# EAGLE design ATRescueBoard (EAGLE 7.7.0)
VERSION: 1.0
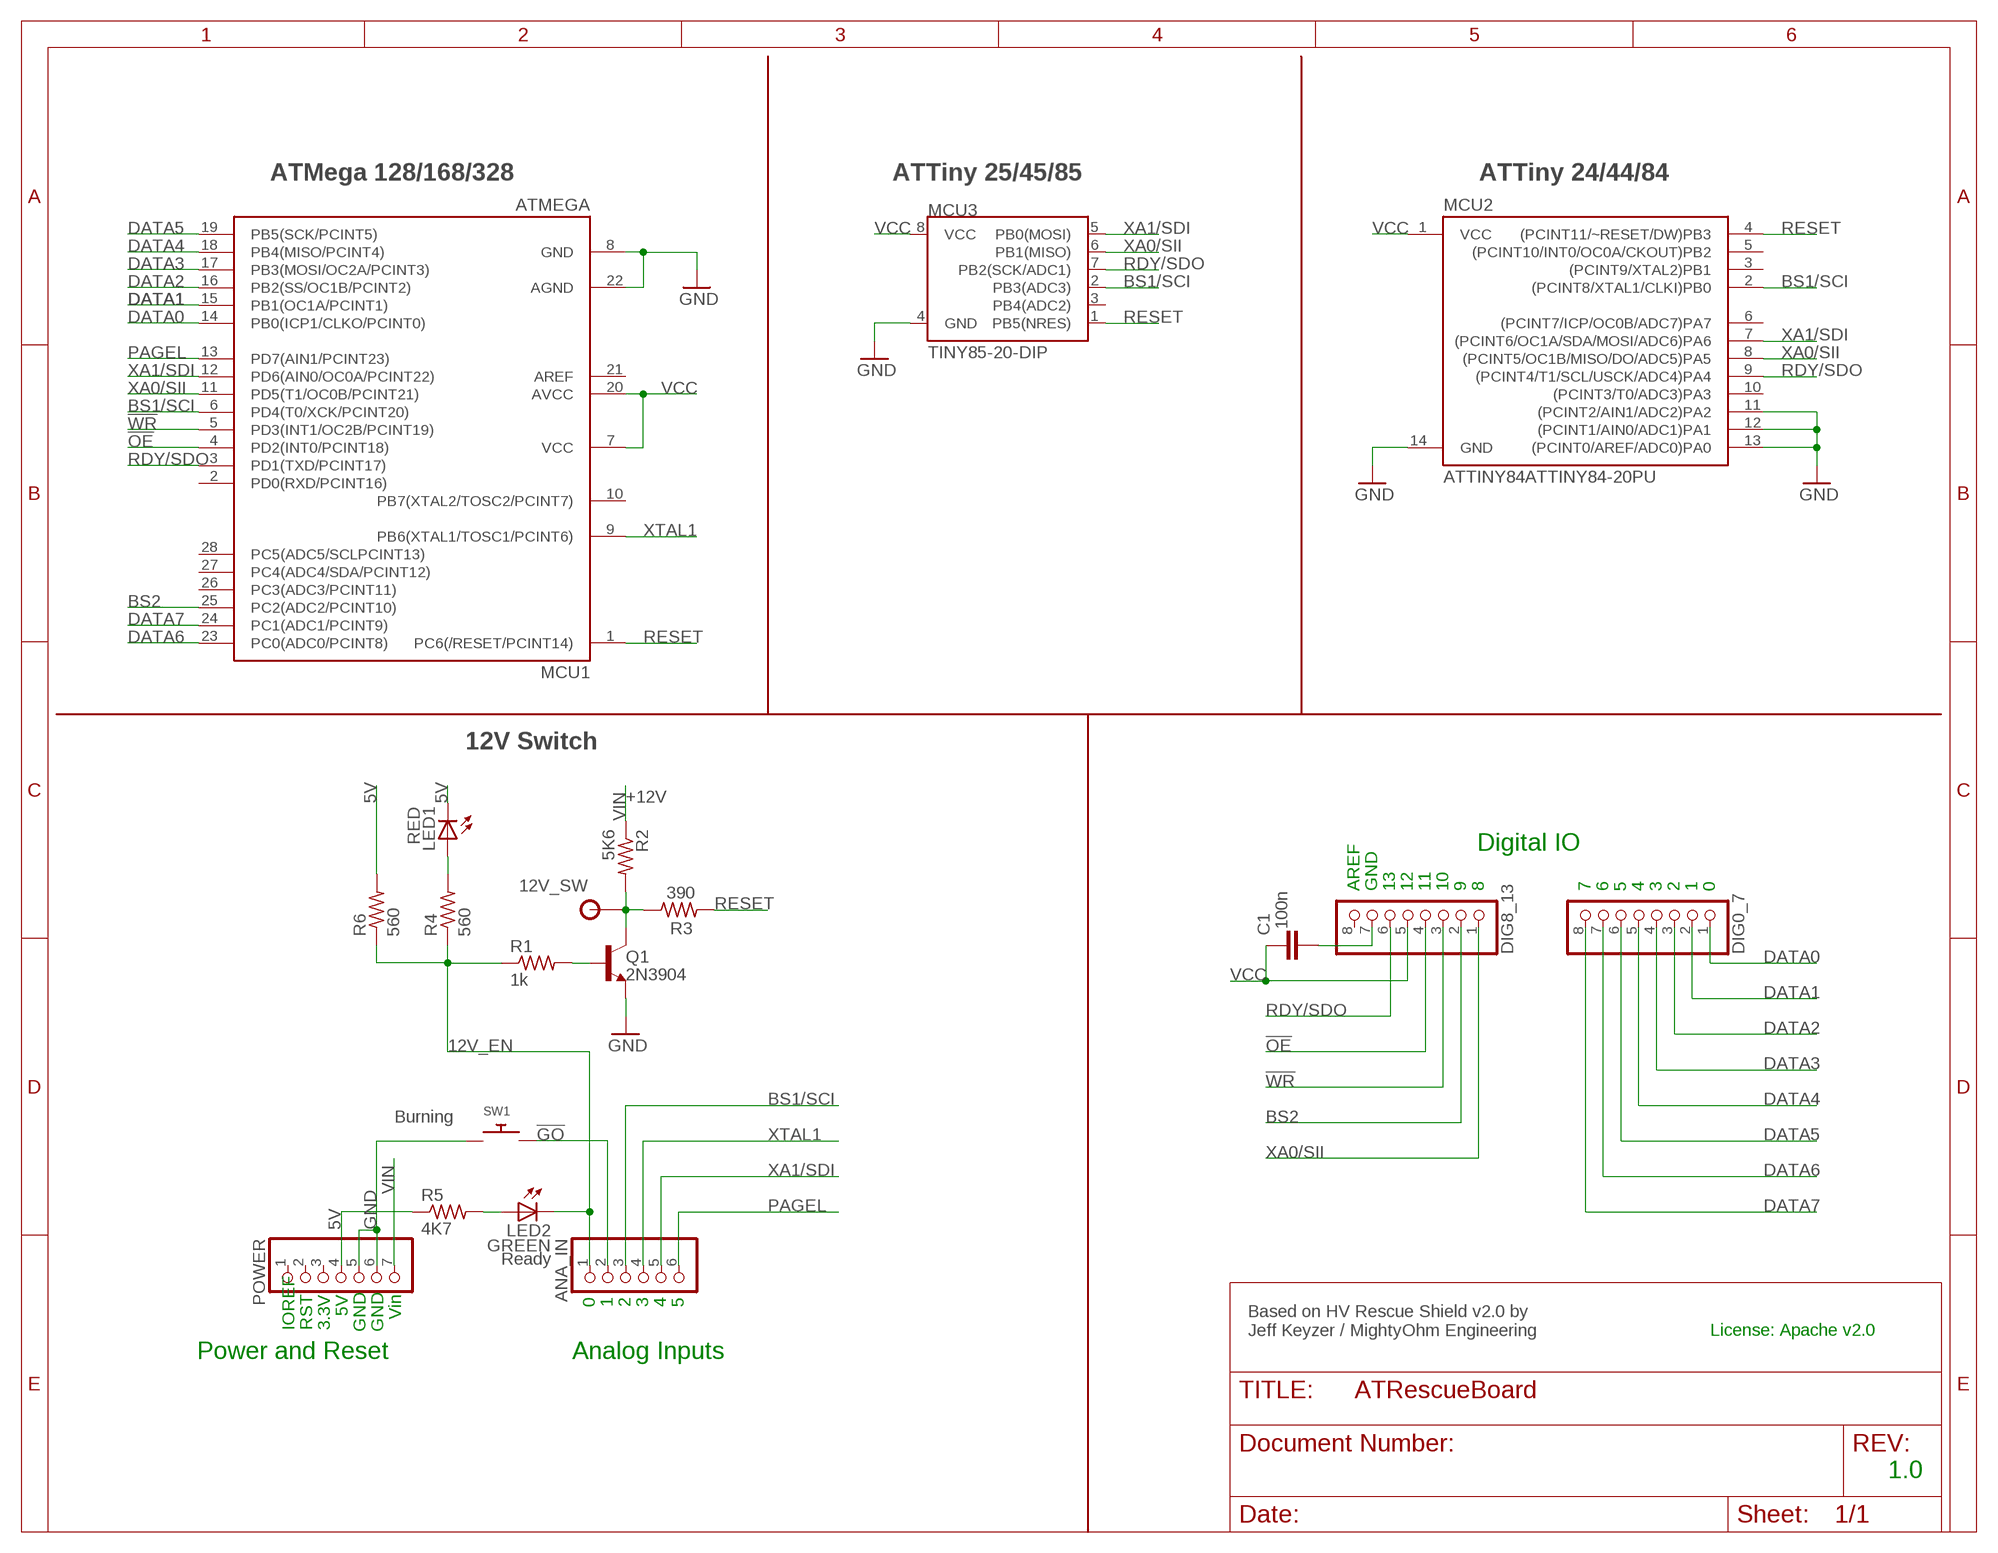
[diagram p0: schematic, sheet 1]

## Parts
ANA_IN  PINHD-1X6  [1X06]
C1  100n  C-EU050-024X044  [C050-024X044]
DIG0_7  PINHD-1X8  [1X08]
DIG8_13  PINHD-1X8  [1X08]
LED1  RED  LED5MM  [LED5MM]
LED2  GREEN  LED5MM  [LED5MM]
MCU1  ATMEGA  MEGA48/88/168-PU  [DIL28-3]
MCU2  ATTINY84ATTINY84-20PU  [DIL14]
MCU3  TINY85-20-DIP  ATTINY45TINY85-20-DIP  [DIP08]
POWER  PINHD-1X7  [1X07]
Q1  2N3904  [TO92-]
R1  1k  R-US_0204/7  [0204/7]
R2  5K6  R-US_0207/10  [0207/10]
R3  390  R-US_0309/12  [0309/12]
R4  560  R-US_0309/12  [0309/12]
R5  4K7  R-US_0204/7  [0204/7]
R6  560  R-US_0309/12  [0309/12]
SW1  SWITCH_PUSHBUTTONEVQ-PE  [TACT_PANA-EVQ]
TP1  12V_SW  TPPTH  [TP_PTH]

## Nets
5V [5v]: LED1.K(C) POWER.4 R5.1 R6.2
12V_EN: ANA_IN.1 LED2.K(C) R1.1 R4.1 R6.1
12V_SW [power]: Q1.1(C) R2.2 R3.1 TP1.P$1(TP)
!GO: ANA_IN.2 SW1.P$2
!OE: DIG8_13.4 MCU1.4(PD2(INT0/PCINT18))
!WR: DIG8_13.3 MCU1.5(PD3(INT1/OC2B/PCINT19))
BS1/SCI: ANA_IN.3 MCU1.6(PD4(T0/XCK/PCINT20)) MCU2.2((PCINT8/XTAL1/CLKI)PB0) MCU3.2(PB3(ADC3))
BS2: DIG8_13.2 MCU1.25(PC2(ADC2/PCINT10))
DATA0: DIG0_7.1 MCU1.14(PB0(ICP1/CLKO/PCINT0))
DATA1: DIG0_7.2 MCU1.15(PB1(OC1A/PCINT1))
DATA2: DIG0_7.3 MCU1.16(PB2(SS/OC1B/PCINT2))
DATA3: DIG0_7.4 MCU1.17(PB3(MOSI/OC2A/PCINT3))
DATA4: DIG0_7.5 MCU1.18(PB4(MISO/PCINT4))
DATA5: DIG0_7.6 MCU1.19(PB5(SCK/PCINT5))
DATA6: DIG0_7.7 MCU1.23(PC0(ADC0/PCINT8))
DATA7: DIG0_7.8 MCU1.24(PC1(ADC1/PCINT9))
GND [gnd]: MCU1.8(GND) MCU1.22(AGND) MCU2.11((PCINT2/AIN1/ADC2)PA2) MCU2.12((PCINT1/AIN0/ADC1)PA1) MCU2.13((PCINT0/AREF/ADC0)PA0) MCU2.14(GND) MCU3.4(GND) POWER.5 POWER.6 Q1.3(E) SW1.P$1
N$1: Q1.2(B) R1.2
N$2: LED1.A R4.2
N$7: LED2.A R5.2
N$21: C1.1 DIG8_13.7
PAGEL: ANA_IN.6 MCU1.13(PD7(AIN1/PCINT23))
RDY/SDO: DIG8_13.6 MCU1.3(PD1(TXD/PCINT17)) MCU2.9((PCINT4/T1/SCL/USCK/ADC4)PA4) MCU3.7(PB2(SCK/ADC1))
RESET [power]: MCU1.1(PC6(/RESET/PCINT14)) MCU2.4((PCINT11/~RESET/DW)PB3) MCU3.1(PB5(NRES)) R3.2
VCC: C1.2 DIG8_13.5 MCU1.7(VCC) MCU1.20(AVCC) MCU2.1(VCC) MCU3.8(VCC)
VIN [power]: POWER.7 R2.1
XA0/SII: DIG8_13.1 MCU1.11(PD5(T1/OC0B/PCINT21)) MCU2.8((PCINT5/OC1B/MISO/DO/ADC5)PA5) MCU3.6(PB1(MISO))
XA1/SDI: ANA_IN.5 MCU1.12(PD6(AIN0/OC0A/PCINT22)) MCU2.7((PCINT6/OC1A/SDA/MOSI/ADC6)PA6) MCU3.5(PB0(MOSI))
XTAL1: ANA_IN.4 MCU1.9(PB6(XTAL1/TOSC1/PCINT6))
Unconnected: DIG8_13.8 MCU1.2(PD0(RXD/PCINT16)) MCU1.10(PB7(XTAL2/TOSC2/PCINT7)) MCU1.21(AREF) MCU1.26(PC3(ADC3/PCINT11)) MCU1.27(PC4(ADC4/SDA/PCINT12)) MCU1.28(PC5(ADC5/SCLPCINT13)) MCU2.3((PCINT9/XTAL2)PB1) MCU2.5((PCINT10/INT0/OC0A/CKOUT)PB2) MCU2.6((PCINT7/ICP/OC0B/ADC7)PA7) MCU2.10((PCINT3/T0/ADC3)PA3) MCU3.3(PB4(ADC2)) POWER.1 POWER.2 POWER.3

## Notes on the sheet
- ATMega 128/168/328 | ATTiny 25/45/85 | ATTiny 24/44/84
- 12V Switch
- +12V
- Digital IO
- AREF | GND | 13 | 12 | 11 | 10 | 9 | 8 | 7 | 6 | 5 | 4 | 3 | 2 | 1 | 0
- Burning
- Ready
- 0 | 1 | 2 | 3 | 4 | 5
- 5V | Vin
- IOREF | RST | 3.3V | GND | GND
- Based on HV Rescue Shield v2.0 by 
  Jeff Keyzer / MightyOhm Engineering
- License: Apache v2.0
- Power and Reset | Analog Inputs

## Library data of the parts
ANA_IN = mightyohm:PINHD-1X6: PIN HEADER
C1 = SmartPrj:C-EU: CAPACITOR, European symbol
DIG0_7 DIG8_13 = mightyohm:PINHD-1X8: PIN HEADER
LED1 LED2 = mightyohm:LED: MightyOhm Engineering Light Emitting Diodes (LEDs)
MCU1 = avr-4:MEGA48/88/168-PU
MCU2 = SparkFun-DigitalIC:ATTINY84: Atmel 14-pin 2/4/8kB flash uC
MCU3 = SparkFun-DigitalIC:ATTINY45: Atmel 8-pin 2/4/8kB flash uC; PROD_ID: IC-09445
POWER = pinhead:PINHD-1X7: PIN HEADER
Q1 = gm-trans:2N3904: NPN Transistor
R1-R6 = rcl:R-US_: RESISTOR, American symbol
SW1 = adafruit:SWITCH_PUSHBUTTON: Buttons SOFTTOUCHSMD_SJ - Soft touch temporary push button (Super Junk Akihabara) Compatible with SKPMANE010 [Mouser: 688-SKPMAN] C&K_KSS = Digikey: KSS221GLFS
TP1 = connectors:TP: Test Point JSK 1/14/11

## Net classes
0 default: width 0.305 mm, drill 0.508 mm, clearance 0.203 mm
1 power: width 0.61 mm, drill 0.508 mm, clearance 0.152 mm
2 gnd: width 0.305 mm, drill 0.508 mm, clearance 0.152 mm
3 5v: width 0.356 mm, drill 0.508 mm, clearance 0.152 mm
4 aref: width 0.406 mm

## Board
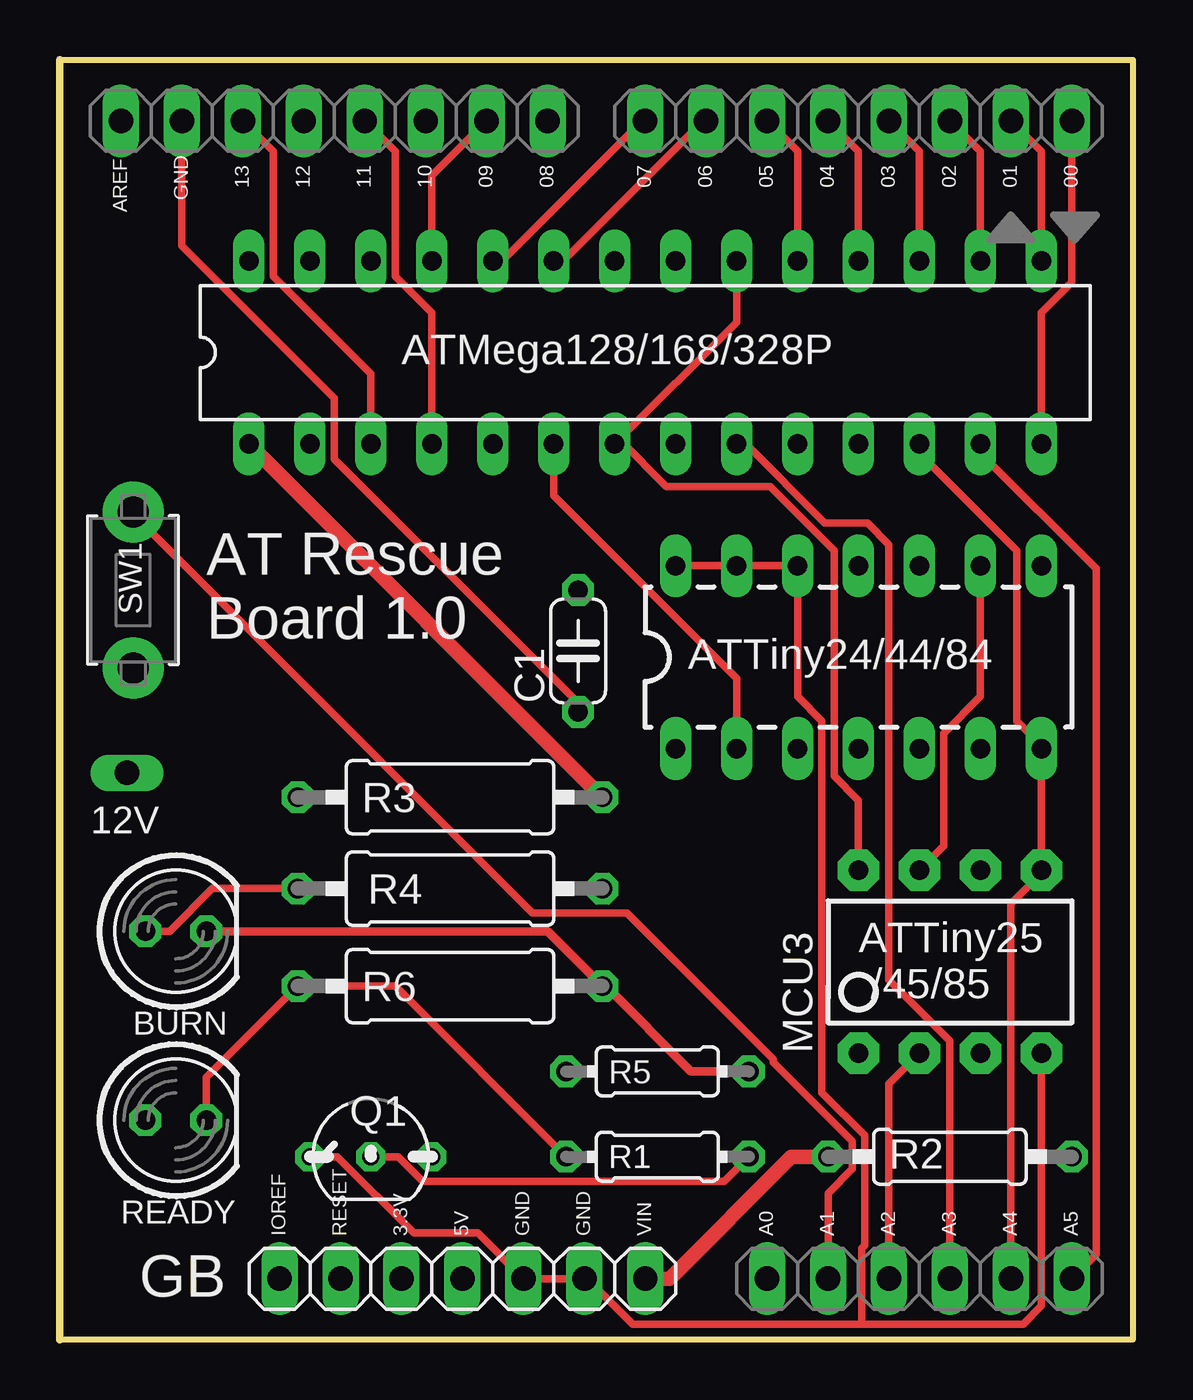
[diagram p1: board, top side]
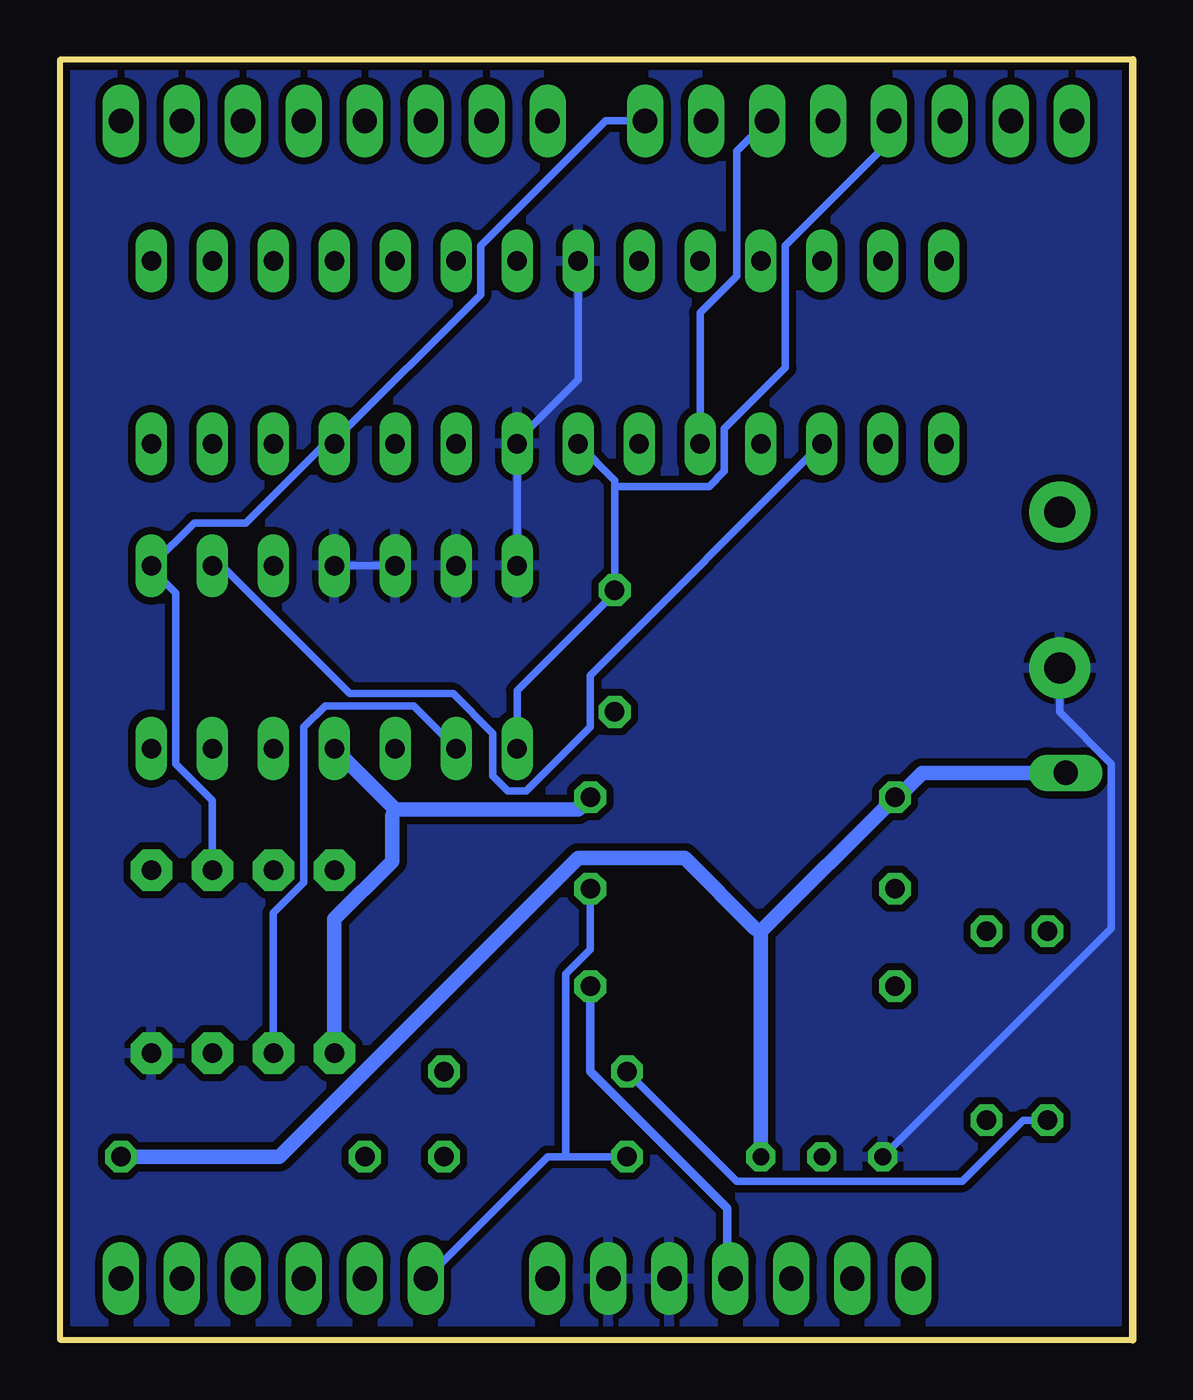
[diagram p2: board, bottom side, seen from below]

Size 44.7 x 53.34 mm. Coordinates in mm from the lower left corner, seen from the top.
Outline: 0,53.34 44.7,53.34 44.7,0 0,0 0,53.34
Copper layers (1*16): Top 0.035mm / dielectric 1.5mm / Bottom 0.035mm
Design rules "SeeedStudio_2layer_DRU_no_angle_20140221": minimum track width 6mil, minimum drill 12mil, track to track 6mil, track to pad 6mil, pad to pad 6mil, via to via 6mil, smd to smd 0mil, copper to edge 10mil, drill to drill 10mil, minimum pad ring 10mil, minimum via ring 6mil, stop-mask expansion 2mil, vias tented up to drill 100mil, thermal gap 10mil
tRestrict: area -18.5,3.6 to -3.3,17
bRestrict: area -18.5,3.6 to -3.3,17

### Footprints (pad centres in the part's own frame; a part is rotated, then mirrored left to right if it is on the bottom)
1X06 = drill 1.016 long: 1 -6.35,0; 2 -3.81,0; 3 -1.27,0; 4 1.27,0; 5 3.81,0; 6 6.35,0
C050-024X044 = drill 0.813 octagon: 1 -2.54,0; 2 2.54,0
1X08 = drill 1.016 long: 1 -8.89,0; 2 -6.35,0; 3 -3.81,0; 4 -1.27,0; 5 1.27,0; 6 3.81,0; 7 6.35,0; 8 8.89,0
LED5MM = drill 0.813 octagon: A -1.27,0; K 1.27,0
DIL28-3 = drill 0.813 long: 1 -16.51,-3.81; 2 -13.97,-3.81; 3 -11.43,-3.81; 4 -8.89,-3.81; 5 -6.35,-3.81; 6 -3.81,-3.81; 7 -1.27,-3.81; 8 1.27,-3.81; 9 3.81,-3.81; 10 6.35,-3.81; 11 8.89,-3.81; 12 11.43,-3.81; 13 13.97,-3.81; 14 16.51,-3.81; 15 16.51,3.81; 16 13.97,3.81; 17 11.43,3.81; 18 8.89,3.81; 19 6.35,3.81; 20 3.81,3.81; 21 1.27,3.81; 22 -1.27,3.81; 23 -3.81,3.81; 24 -6.35,3.81; 25 -8.89,3.81; 26 -11.43,3.81; 27 -13.97,3.81; 28 -16.51,3.81
DIL14 = drill 0.813 long: 1 -8.89,-3.81; 2 -6.35,-3.81; 3 -3.81,-3.81; 4 -1.27,-3.81; 5 1.27,-3.81; 6 3.81,-3.81; 7 6.35,-3.81; 8 6.35,3.81; 9 3.81,3.81; 10 1.27,3.81; 11 -1.27,3.81; 12 -3.81,3.81; 13 -6.35,3.81; 14 -8.89,3.81
DIP08 = drill 0.813 pad 1.727 octagon: 1 -3.81,-3.81; 2 -1.27,-3.81; 3 1.27,-3.81; 4 3.81,-3.81; 5 3.81,3.81; 6 1.27,3.81; 7 -1.27,3.81; 8 -3.81,3.81
1X07 = drill 1.016 long: 1 -7.62,0; 2 -5.08,0; 3 -2.54,0; 4 0,0; 5 2.54,0; 6 5.08,0; 7 7.62,0
TO92- = drill 0.7 octagon: 1 2.54,0; 2 0,0; 3 -2.54,0
0204/7 = drill 0.813 octagon: 1 -3.81,0; 2 3.81,0
0207/10 = drill 0.813 octagon: 1 -5.08,0; 2 5.08,0
0309/12 = drill 0.813 octagon: 1 -6.35,0; 2 6.35,0
TACT_PANA-EVQ = drill 1.3 pad 2.54: P$1 -3.25,0; P$2 3.25,0
TP_PTH = drill 1.016 long: P$1 0,0

### Placement (x,y rotation side)
ANA_IN  35.81,2.54 0 top
C1  21.59,28.7 90 top
DIG0_7  33.27,50.8 180 top
DIG8_13  11.43,50.8 180 top
DRILEGEND  [DRILEGEND]  -18.71,-4.04 0 top  (outside the outline)
LED1  4.83,17.02 0 top
LED2  4.83,9.14 0 top
MCU1  24.38,41.15 0 top
MCU2  34.54,28.45 0 top
MCU3  37.08,15.75 0 top
POWER  16.77,2.54 0 top
Q1  12.95,7.62 0 top
R1  24.89,7.62 0 top
R2  37.08,7.62 0 top
R3  16.26,22.61 0 top
R4  16.26,18.8 180 top
R5  24.89,11.18 180 top
R6  16.26,14.73 0 top
SW1  3.05,31.24 90 top
TP1  2.79,23.62 180 top

### Tracks (layer width: path | path; a pad name or v marks a point on that pad's centre or on a via)
5V
  Top 0.356: LED1.K 20.32,17.02 R6.2 22.73,14.73 26.29,11.18 R5.1
  Bottom 0.356: R6.2 22.61,11.18 16.89,5.46 16.89,2.54 POWER.4
12V_EN
  Top 0.305: LED2.K 6.1,10.92 R6.1 13.97,14.73 R1.1
  Bottom 0.305: 23.62,7.62 24.38,7.62 ANA_IN.1 | 23.62,7.62 R1.1 | R4.1 22.61,16.26 23.62,15.24 23.62,7.62
12V_SW
  Bottom 0.61: 15.49,17.02 Q1.1 | 15.49,17.02 R3.1 9.65,22.73 8.76,23.62 TP1.P$1 | R2.2 35.56,7.62 23.11,20.07 18.67,20.07 15.75,17.14 15.49,17.02
!GO
  Top 0.305: ANA_IN.2 32,6.1 33.02,7.11 33.02,8.26 29.72,11.56 29.72,11.68 23.62,17.78 19.68,17.78 3.05,34.42 SW1.P$2
!OE
  Top 0.305: MCU1.4 15.49,42.8 13.97,44.32 13.97,49.53 DIG8_13.4
!WR
  Bottom 0.305: MCU1.5 18.03,42.8 16.51,44.32 16.51,49.53 DIG8_13.3
BS1/SCI
  Top 0.305: ANA_IN.3 34.54,10.67 MCU3.2 | MCU2.2 28.19,27.56 20.57,35.18 MCU1.6
  Bottom 0.305: MCU3.2 35.81,17.78 34.54,19.05 34.54,25.53 33.66,26.42 29.97,26.42 MCU2.2
BS2
  Top 0.305: MCU1.25 15.49,48.51 DIG8_13.2
DATA0
  Top 0.305: MCU1.14 40.89,42.8 42.16,44.07 DIG0_7.1
DATA1
  Top 0.305: MCU1.15 40.89,49.53 DIG0_7.2
DATA2
  Top 0.305: MCU1.16 38.35,49.53 DIG0_7.3
DATA3
  Top 0.305: MCU1.17 35.81,49.53 DIG0_7.4
DATA4
  Top 0.305: MCU1.18 33.27,49.53 DIG0_7.5
DATA5
  Top 0.305: MCU1.19 30.73,49.53 DIG0_7.6
DATA6
  Top 0.305: MCU1.23 20.95,44.96 26.8,50.8 DIG0_7.7
DATA7
  Top 0.305: MCU1.24 18.41,44.96 24.26,50.8 DIG0_7.8
GND
  Top 0.305: MCU2.14 MCU2.13 MCU2.12 30.73,26.8 31.75,25.78 31.75,10.29 33.53,8.51 33.53,3.94 33.4,3.81 33.4,0.64 | Q1.3 11.56,7.62 14.73,4.45 17.4,4.45 POWER.5 POWER.6 21.97,2.54 23.88,0.64 33.4,0.64 | MCU3.4 40.89,1.4 40.13,0.64 33.4,0.64
  Bottom 0.305: MCU2.14 MCU1.8 25.65,37.47 23.11,40.01 MCU1.22 | MCU2.12 MCU2.11 | SW1.P$1 3.05,26.16 0.89,24 0.89,17.14 Q1.3
  pour Bottom (isolate 0.305): 0.51,53.09 44.2,53.09 44.2,0.76 0.51,0.76 0.51,52.83
N$1
  Top 0.305: Q1.2 14.1,7.62 15.11,6.6 27.69,6.6 R1.2
N$2
  Top 0.305: LED1.A 4.57,17.02 6.35,18.8 R4.2
N$7
  Bottom 0.305: LED2.A 4.57,9.14 7.11,6.6 16.51,6.6 R5.2
N$21
  Top 0.305: C1.1 21.59,26.54 11.43,36.7 11.43,39.24 5.08,45.59 DIG8_13.7
PAGEL
  Top 0.305: MCU1.13 38.35,36.96 43.18,32.13 43.18,3.56 ANA_IN.6
RDY/SDO
  Top 0.305: MCU2.9 38.35,26.8 36.83,25.27 36.83,20.57 MCU3.7 | MCU1.3 12.95,40.26 8.89,44.32 8.89,49.53 DIG8_13.6
  Bottom 0.305: MCU2.9 37.97,32.26 32.64,26.92 28.32,26.92 26.67,25.27 26.67,23.5 26.04,22.86 25.27,22.86 22.61,25.53 22.61,27.69 MCU1.3
RESET
  Top 0.61: R3.2 MCU1.1
  Bottom 0.61: 30.73,22.1 MCU2.4 | 30.73,22.1 23.11,22.1 R3.2 | MCU3.1 33.27,17.53 30.86,19.94 30.86,21.84 30.73,22.1
VCC
  Top 0.305: MCU1.20 28.19,42.42 MCU1.7 23.37,37.47 25.27,35.56 29.59,35.56 32.26,32.89 32.26,23.5 33.27,22.48 MCU3.8
  Bottom 0.305: 21.59,35.56 21.59,35.81 MCU1.7 | 21.59,35.56 C1.2 21.59,31.11 25.65,27.05 MCU2.1 | DIG8_13.5 10.16,49.91 14.48,45.59 14.48,40.51 17.02,37.97 17.02,36.2 17.65,35.56 21.59,35.56
VIN
  Top 0.61: R2.1 30.48,7.62 25.4,2.54 POWER.7
XA0/SII
  Bottom 0.305: DIG8_13.1 21.97,50.8 27.18,45.59 27.18,43.56 33.27,37.47 MCU1.11 33.66,37.34 36.96,34.04 39.12,34.04 MCU2.8 40.89,32.13 39.88,31.11 39.88,24 38.35,22.48 MCU3.6
XA1/SDI
  Top 0.305: MCU1.12 35.81,36.96 39.88,32.89 39.88,25.78 40.89,24.77 MCU2.7 MCU3.5 40.89,19.43 39.62,18.16 ANA_IN.5
XTAL1
  Top 0.305: MCU1.9 28.57,37.34 31.88,34.04 33.66,34.04 34.54,33.15 34.54,14.99 37.08,12.45 ANA_IN.4

### Text on the board
tPlace: 13 | 12 | 11 | 10 | 09 | 08 | 07 | 06 | 05 | 04 | 03 | 02 | 01 | 00 | AREF | GND | ATMega128/168/328P | AT Rescue / Board 1.0 | ATTiny24/44/84 | ATTiny25 / /45/85 | BURN | READY | IOREF | RESET | 3.3V | 5V | GND | GND | VIN | A0 | A1 | A2 | A3 | A4 | A5
tNames: 12V | GB
tDocu: 3 2 1 0 9 8 | 7 6 5 4 3 2 1 0 | GND | 1 1 1 1 | DIGITAL | AREF | TX | RX | PWM | PWM | PWM | PWM | PWM | PWM | ANALOG IN | RESET | 3V3 | 5V Gnd Vin | 0 1 2 3 4 5